# EAGLE design ADIS Teensy Arduino Breakout RevC (EAGLE 7.7.0)

## Sheet 1 of 2
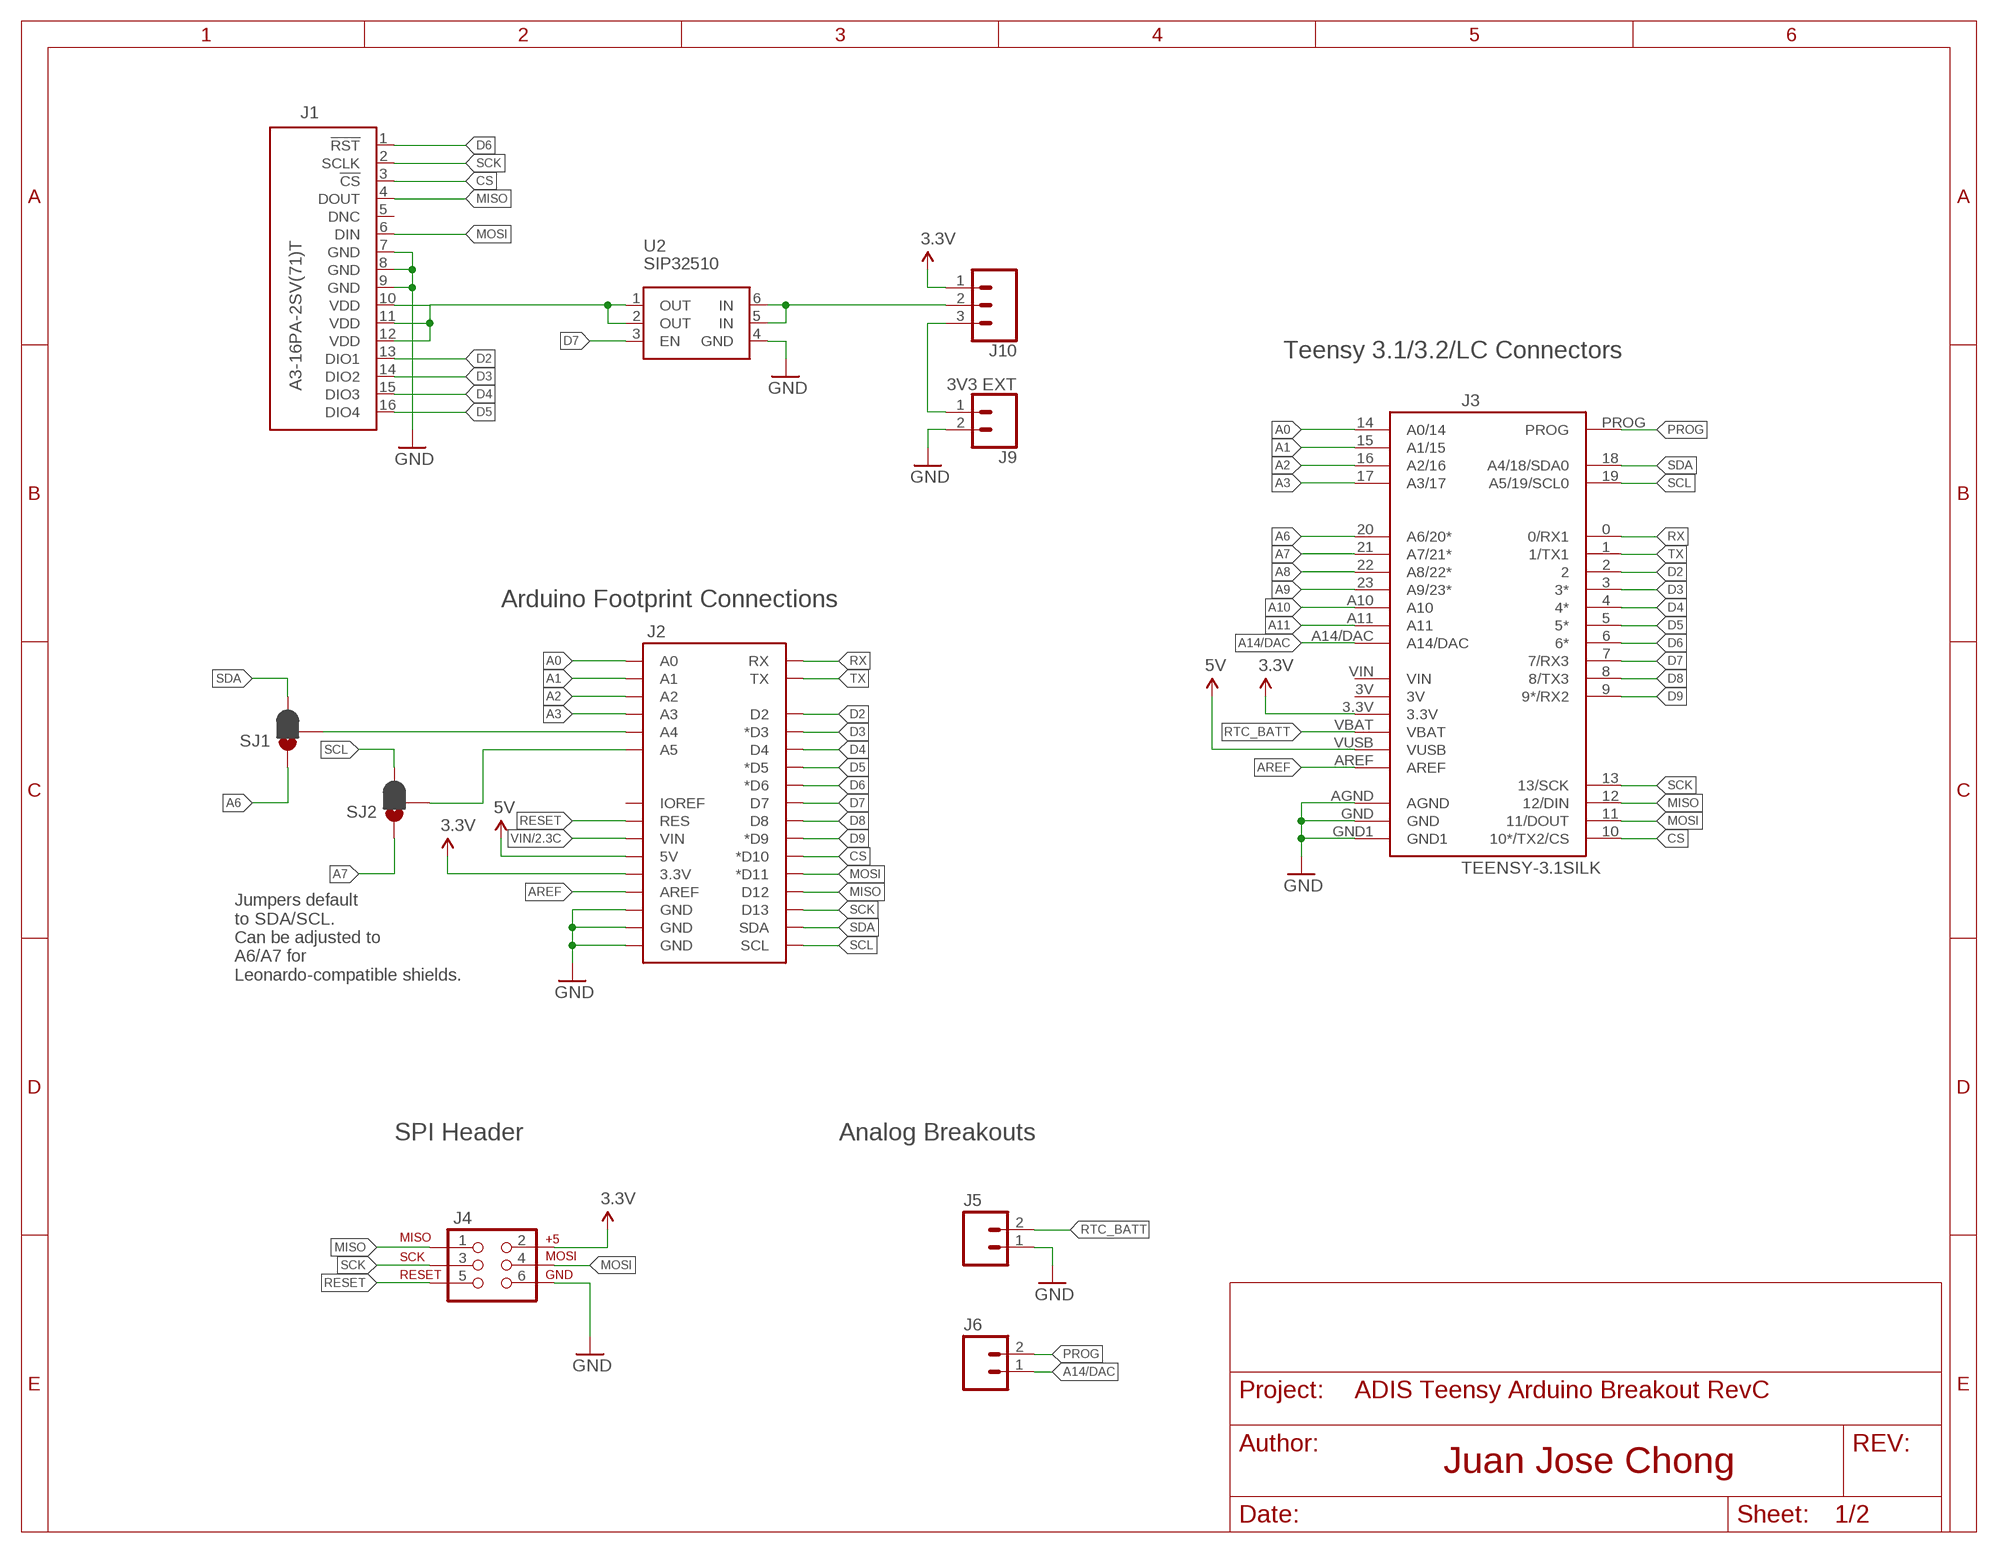
[diagram p0: schematic, sheet 1]

### Parts
J1  A3-16PA-2SV(71)T  [A3-16PA-2SV(71)-TOP]
J2  ARDUINO_R3_SHIELDUNO_R3_SHIELD_HOLES  [UNO_R3_SHIELD_HOLES]
J3  TEENSY-3.1SILK  [TEENSY-3.1]
J4  AVR_SPI_PRG_6PTH  [2X3]
J5  M02PTH  [1X02@1]
J6  M02PTH  [1X02@1]
J9  3V3 EXT  CONN_023.5MM  [SCREWTERMINAL-3.5MM-2]
J10  CONN_03  [1X03]
SJ1  JUMPER-PAD-3-2OF3_NC_BY_PASTE  [PAD-JUMPER-3-2OF3_NC_BY_PASTE_YES_SILK_FULL_BOX]
SJ2  JUMPER-PAD-3-2OF3_NC_BY_PASTE  [PAD-JUMPER-3-2OF3_NC_BY_PASTE_YES_SILK_FULL_BOX]
U2  SIP32510  [SOT23-6]

### Nets
3.3V: J2.3.3V J3.3.3V J4.2 J10.1 ; also sheet 2
5V: J2.5V J3.VUSB ; also sheet 2
A0: J2.A0 J3.14(A0/14)
A1: J2.A1 J3.15(A1/15)
A2: J2.A2 J3.16(A2/16)
A3: J2.A3 J3.17(A3/17)
A4: J2.A4 SJ1.2
A5: J2.A5 SJ2.2
A6: J3.20(A6/20*) SJ1.1
A7: J3.21(A7/21*) SJ2.1
A8: J3.22(A8/22*)
A9: J3.23(A9/23*)
A10: J3.A10
A11: J3.A11
A14/DAC: J3.A14/DAC J6.1
AREF: J2.AREF J3.AREF
CS: J1.3(!CS) J2.D10(*D10) J3.10(10*/TX2/CS)
D2: J1.13(DIO1) J2.D2 J3.2
D3: J1.14(DIO2) J2.D3(*D3) J3.3(3*)
D4: J1.15(DIO3) J2.D4 J3.4(4*)
D5: J1.16(DIO4) J2.D5(*D5) J3.5(5*)
D6: J1.1(!RST) J2.D6(*D6) J3.6(6*)
D7: J2.D7 J3.7(7/RX3) U2.3(EN)
D8: J2.D8 J3.8(8/TX3)
D9: J2.D9(*D9) J3.9(9*/RX2)
GND: J1.7(GND) J1.8(GND) J1.9(GND) J2.GND@0(GND) J2.GND@1(GND) J2.GND@2(GND) J3.AGND J3.GND J3.GND1 J4.6 J5.1 J9.2 U2.4(GND) ; also sheet 2
MISO: J1.4(DOUT) J2.D12 J3.12(12/DIN) J4.1
MOSI: J1.6(DIN) J2.D11(*D11) J3.11(11/DOUT) J4.4
N$8: J1.10(VDD) J1.11(VDD) J1.12(VDD) U2.1(OUT) U2.2(OUT)
N$10: J9.1 J10.3
N$11: J10.2 U2.5(IN) U2.6(IN)
PROG: J3.PROG J6.2
RESET: J2.RES J4.5
RTC_BATT: J3.VBAT J5.2
RX: J2.RX J3.0(0/RX1)
SCK: J1.2(SCLK) J2.D13 J3.13(13/SCK) J4.3
SCL: J2.SCL J3.19(A5/19/SCL0) SJ2.3
SDA: J2.SDA J3.18(A4/18/SDA0) SJ1.3
TX: J2.TX J3.1(1/TX1)
VIN: J2.VIN ; also sheet 2
Unconnected: J1.5(DNC) J2.IOREF J3.3V J3.VIN

### Notes on the sheet
- Teensy 3.1/3.2/LC Connectors
- Arduino Footprint Connections
- Jumpers default
  to SDA/SCL.
  Can be adjusted to 
  A6/A7 for
  Leonardo-compatible shields.
- SPI Header | Analog Breakouts

## Sheet 2 of 2
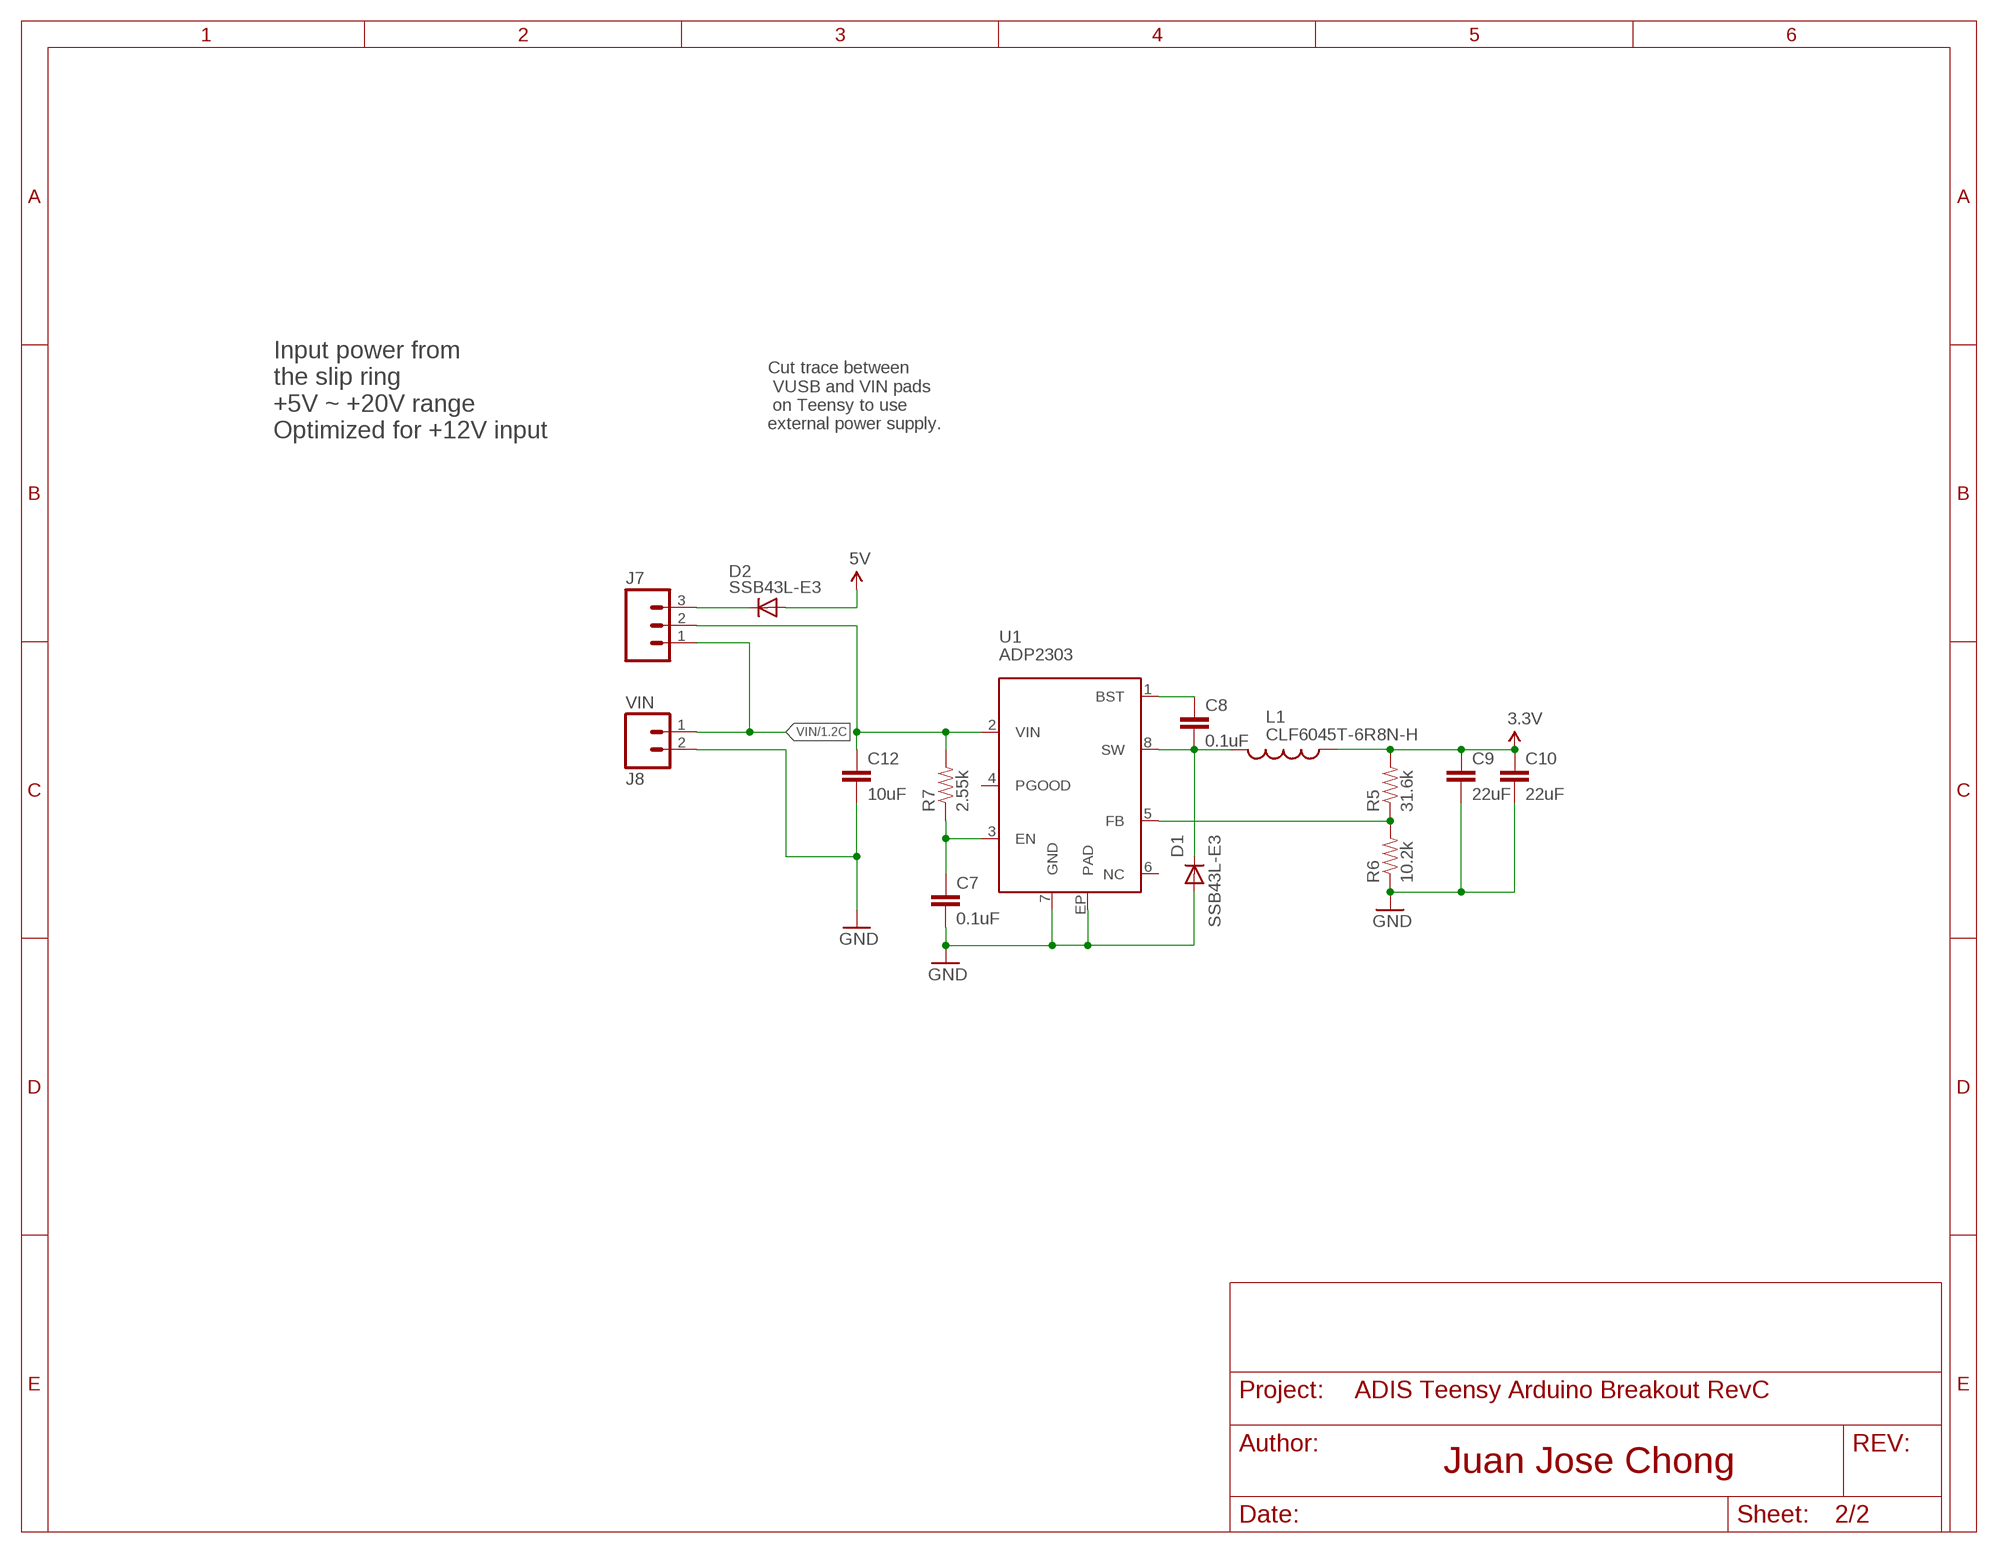
[diagram p1: schematic, sheet 2]

### Parts
C7  0.1uF  CAP0603-CAP  [0603-CAP]
C8  0.1uF  CAP0603-CAP  [0603-CAP]
C9  22uF  CAP1210  [1210]
C10  22uF  CAP1210  [1210]
C12  10uF  CAP1206  [1206]
D1  SSB43L-E3  DIODE-DO214AA  [DO214AA]
D2  SSB43L-E3  DIODE-DO214AA  [DO214AA]
J7  M03PTH  [1X03@1]
J8  VIN  M023.5MM  [SCREWTERMINAL-3.5MM-2@1]
L1  CLF6045T-6R8N-H  [CLF6045-H]
R5  31.6k  RESISTOR0603-RES  [0603-RES]
R6  10.2k  RESISTOR0603-RES  [0603-RES]
R7  2.55k  RESISTOR0603-RES  [0603-RES]
U1  ADP2303  [SOIC-8-PAD]

### Nets
3.3V: C9.1 C10.1 L1.P$1 R5.2 ; also sheet 1
5V: D2.A ; also sheet 1
GND: C7.2 C9.2 C10.2 C12.2 D1.A J8.2 R6.1 U1.7(GND) U1.EP(PAD) ; also sheet 1
N$2: R5.1 R6.2 U1.5(FB)
N$3: C8.2 D1.C L1.P$2 U1.8(SW)
N$4: C8.1 U1.1(BST)
N$5: C7.1 R7.1 U1.3(EN)
N$6: C12.1 J7.2 R7.2 U1.2(VIN)
N$7: D2.C J7.3
VIN: J7.1 J8.1 ; also sheet 1
Unconnected: U1.4(PGOOD) U1.6(NC)

### Notes on the sheet
- Cut trace between
   VUSB and VIN pads
   on Teensy to use 
  external power supply.
- Input power from 
  the slip ring
  +5V ~ +20V range
  Optimized for +12V input

## Library data of the parts
C7 C8 = SparkFun-Passives:CAP: Capacitor Standard 0603 ceramic capacitor, and 0.1" leaded capacitor.; PARTNO: CL10B104KB8NNNC
C9 C10 C12 = SparkFun-Passives:CAP: Capacitor Standard 0603 ceramic capacitor, and 0.1" leaded capacitor.; PARTNO: TLJA476M010R0600
D1 D2 = Chong:DIODE-: DIODE; PARTNO: SSB43L-E3/52T
J1 = Analog Devices iSensors:A3-16PA-2SV(71); PARTNO: A3-16PA-2SV(71)
J2 = Testing:ARDUINO_R3_SHIELD: Shield form compatible with the Arduino Uno R3.
J3 = Testing:TEENSY-3.1; PARTNO: TEENSY32; SF_ID: DEV-12646
J4 = SparkFun-Connectors:AVR_SPI_PRG_6: AVR ISP 6 Pin This is the reduced ISP connector for AVR programming. Common on Arduino. This footprint will take up less PCB space and can be used with a 10-pin to 6-pin adapter such as SKU: BOB-08508 **Special note about "TEST_POINT" package. The stop mask is on the top side, so if you want your programming test points to be on the bottom of your board, make sure to place this package on the bottom side of the board. This also ensure that the orientation to program from the bottom side will be correct.; PARTNO: M20-9720345
J5 J6 = SparkFun-Connectors:M02: Standard 2-pin 0.1" header. Use with - straight break away headers ( PRT-00116) - right angle break away headers (PRT-00553) - swiss pins (PRT-00743) - machine pins (PRT-00117) - female headers (PRT-00115) Molex polarized connector foot print use with: PRT-08233 with associated crimp pins and housings. 2.54_SCREWTERM for use with PRT-10571. 3.5mm Screw Terminal footprints for PRT-08084 5mm Screw Terminal footprints for use with PRT-08432
J7 = SparkFun-Connectors:M03: Header 3 Standard 3-pin 0.1" header. Use with straight break away headers (SKU : PRT-00116), right angle break away headers (PRT-00553), swiss pins (PRT-00743), machine pins (PRT-00117), and female headers (PRT-00115). Molex polarized connector foot print use with SKU : PRT-08232 with associated crimp pins and housings.; PARTNO: 68000-103HLF
J8 = SparkFun-Connectors:M02: Standard 2-pin 0.1" header. Use with - straight break away headers ( PRT-00116) - right angle break away headers (PRT-00553) - swiss pins (PRT-00743) - machine pins (PRT-00117) - female headers (PRT-00115) Molex polarized connector foot print use with: PRT-08233 with associated crimp pins and housings. 2.54_SCREWTERM for use with PRT-10571. 3.5mm Screw Terminal footprints for PRT-08084 5mm Screw Terminal footprints for use with PRT-08432; PARTNO: 20020327-C021B01LF
J9 = SparkFun-Connectors:CONN_02: Multi connection point. Often used as Generic Header-pin footprint for 0.1 inch spaced/style header connections On any of the 0.1 inch spaced packages, you can populate with these: Break Away Headers - Straight <https://www.sparkfun.com/products/116> (PRT-00116) Break Away Male Headers - Right Angle <https://www.sparkfun.com/products/553> (PRT-00553) Female Headers <https://www.sparkfun.com/products/115> (PRT-00115) Break Away Headers - Machine Pin <https://www.sparkfun.com/products/117> (PRT-00117) Break Away Female Headers - Swiss Machine Pin <https://www.sparkfun.com/products/743> (PRT-00743) For SCREWTERMINALS and SPRING TERMINALS visit here: Screw Terimnals on SparkFun.com <https://www.sparkfun.com/search/results?term=Screw+Terminals> (5mm/3.5mm/2.54mm spacing) This device is also useful as a general connection point to wire up your design to another part of your project. Our various solder wires solder well into these plated through hole pads. Hook-Up Wire - Assortment (Stranded, 22 AWG) <https://www.sparkfun.com/products/11375> (PRT-11375) Hook-Up Wire - Assortment (Solid Core, 22 AWG) <https://www.sparkfun.com/products/11367> (PRT-11367) View the entire wire category on our website here <https://www.sparkfun.com/categories/141> Special notes: Molex polarized connector foot print use with: PRT-08233 with associated crimp pins and housings. 2.54_SCREWTERM for use with PRT-10571. 3.5mm Screw Terminal footprints for PRT-08084 5mm Screw Terminal footprints for use with PRT-08432; PARTNO: 20020327-C021B01LF; PROD_ID: CONN-08399
J10 = SparkFun-Connectors:CONN_03: Multi connection point. Often used as Generic Header-pin footprint for 0.1 inch spaced/style header connections On any of the 0.1 inch spaced packages, you can populate with these: Break Away Headers - Straight <https://www.sparkfun.com/products/116> (PRT-00116) Break Away Male Headers - Right Angle <https://www.sparkfun.com/products/553> (PRT-00553) Female Headers <https://www.sparkfun.com/products/115> (PRT-00115) Break Away Headers - Machine Pin <https://www.sparkfun.com/products/117> (PRT-00117) Break Away Female Headers - Swiss Machine Pin <https://www.sparkfun.com/products/743> (PRT-00743) Stackable Header - 3 Pin (Female, 0.1") <https://www.sparkfun.com/products/13875> (PRT-13875) For SCREWTERMINALS and SPRING TERMINALS visit here: Screw Terimnals on SparkFun.com <https://www.sparkfun.com/search/results?term=Screw+Terminals> (5mm/3.5mm/2.54mm spacing) This device is also useful as a general connection point to wire up your design to another part of your project. Our various solder wires solder well into these plated through hole pads. Hook-Up Wire - Assortment (Stranded, 22 AWG) <https://www.sparkfun.com/products/11375> (PRT-11375) Hook-Up Wire - Assortment (Solid Core, 22 AWG) <https://www.sparkfun.com/products/11367> (PRT-11367) View the entire wire category on our website here <https://www.sparkfun.com/categories/141> Special notes: Molex polarized connector foot print use with SKU : PRT-08232 with associated crimp pins and housings.; PARTNO: 68000-103HLF
L1 = AnalogDevices:CLF6045T-6R8N-H; PARTNO: CLF6045T-6R8N-H
R5 = SparkFun-Passives:RESISTOR: Resistor Basic schematic elements and footprints for 0603, 1206, and PTH resistors.; PARTNO: ERJ-3EKF3162V
R6 = SparkFun-Passives:RESISTOR: Resistor Basic schematic elements and footprints for 0603, 1206, and PTH resistors.; PARTNO: ERJ-3EKF1022V
R7 = SparkFun-Passives:RESISTOR: Resistor Basic schematic elements and footprints for 0603, 1206, and PTH resistors.; PARTNO: ERJ-3EKF2551V
SJ1 SJ2 = SparkFun-Passives:JUMPER-PAD-3-2OF3_NC_BY_PASTE
U1 = AnalogDevices:ADP2303; PARTNO: ADP2303ARDZ
U2 = Chong:SIP32510; PARTNO: SIP32510DT-T1-GE3

## Board
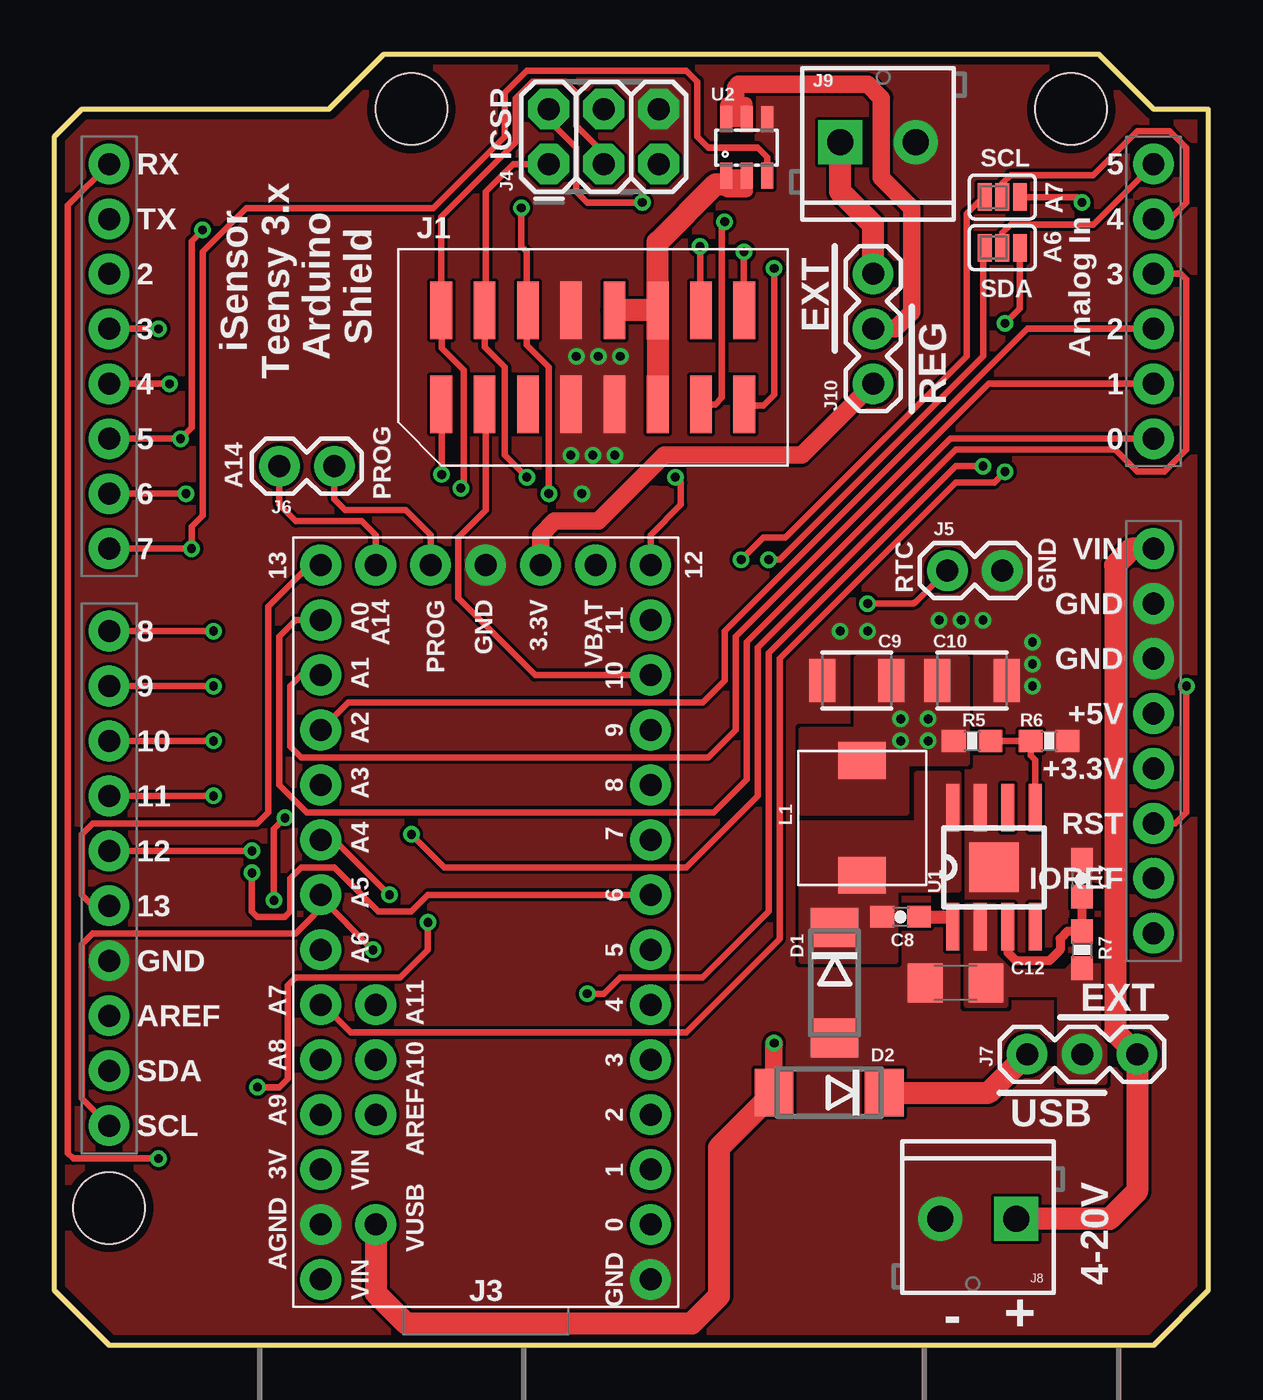
[diagram p2: board, top side]
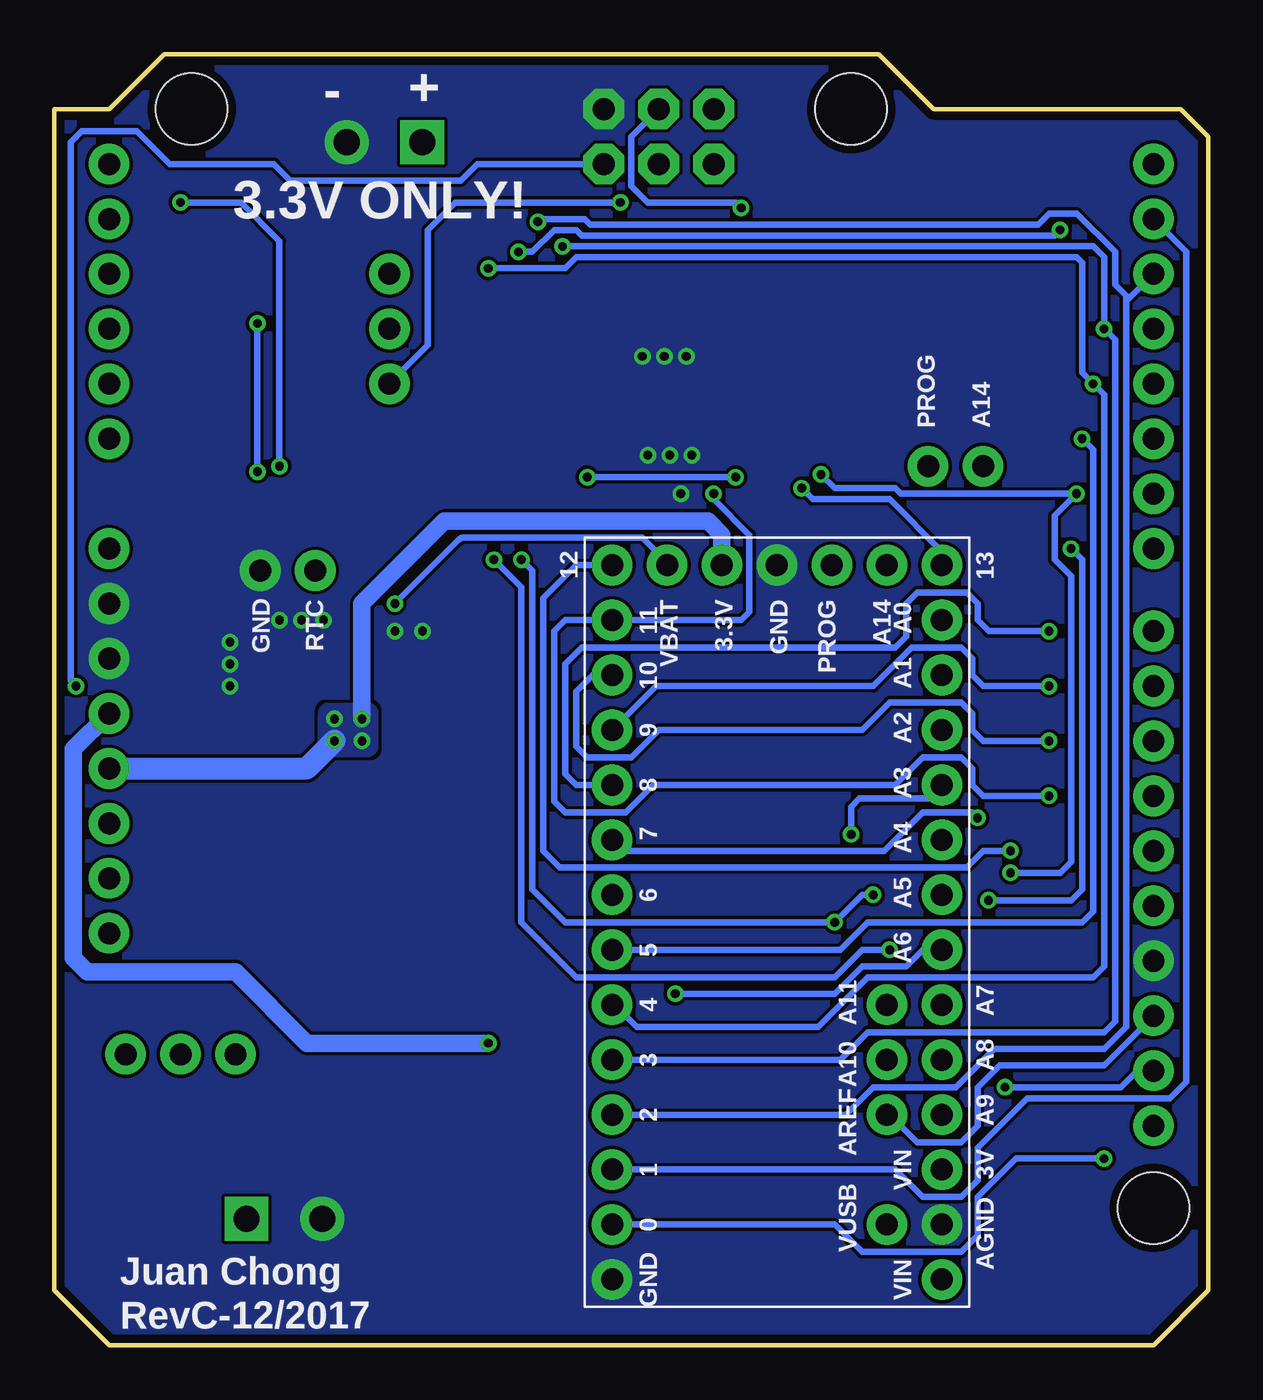
[diagram p3: board, bottom side, seen from below]

Size 53.34 x 59.69 mm. Coordinates in mm from the lower left corner, seen from the top.
Outline: 0,2.54 2.54,0 50.8,0 53.34,2.54 53.34,57.15 50.8,57.15 48.26,59.69 15.24,59.69 12.7,57.15 1.27,57.15 0,55.88 0,2.54
Copper layers (1*16): Top 0.0356mm / dielectric 1.5011mm / Bottom 0.0356mm
Design rules "LaenPCBOrder_FilledVias *": minimum track width 6mil, minimum drill 10mil, track to track 6mil, track to pad 6mil, pad to pad 6mil, via to via 6mil, smd to smd 6mil, copper to edge 15mil, drill to drill 6mil, minimum pad ring 7mil, minimum via ring 7mil, stop-mask expansion 4mil, vias tented up to drill 17mil, thermal gap 10mil
tRestrict: 10 lines
bRestrict: 1 lines

### Footprints (pad centres in the part's own frame; a part is rotated, then mirrored left to right if it is on the bottom)
0603-CAP = smd 1.1 x 1: 1 -0.85,0; 2 0.85,0
1210 = smd 1.2 x 2: 1 -1.6,0; 2 1.6,0
1206 = smd 1.6 x 1.8: 1 -1.4,0; 2 1.4,0
DO214AA = smd 1.8 x 2.2: A 2.55,0; C -2.55,0
A3-16PA-2SV(71)-TOP = smd 1 x 2.65: 1 -7,-2.225; 2 -7,2.125; 3 -5,-2.225; 4 -5,2.125; 5 -3,-2.225; 6 -3,2.125; 7 -1,-2.225; 8 -1,2.125; 9 1,-2.225; 10 1,2.125; 11 3,-2.225; 12 3,2.125; 13 5,-2.225; 14 5,2.125; 15 7,-2.225; 16 7,2.125
UNO_R3_SHIELD_HOLES = drill 1.016 pad 1.88: 3.3V 50.8,26.67; 5V 50.8,29.21; A0 50.8,41.91; A1 50.8,44.45; A2 50.8,46.99; A3 50.8,49.53; A4 50.8,52.07; A5 50.8,54.61; AREF 2.54,15.24; D2 2.54,49.53; D3 2.54,46.99; D4 2.54,44.45; D5 2.54,41.91; D6 2.54,39.37; D7 2.54,36.83; D8 2.54,33.02; D9 2.54,30.48; D10 2.54,27.94; D11 2.54,25.4; D12 2.54,22.86; D13 2.54,20.32; GND@0 50.8,31.75; GND@1 50.8,34.29; GND@2 2.54,17.78; IOREF 50.8,21.59; NC 50.8,19.05; RES 50.8,24.13; RX 2.54,54.61; SCL 2.54,10.16; SDA 2.54,12.7; TX 2.54,52.07; VIN 50.8,36.83 | hole 3.302: 2.54,6.35; 46.99,57.15; 16.51,57.15
TEENSY-3.1 = drill 1.016 pad 1.88: 0 16.51,3.81; 1 16.51,6.35; 2 16.51,8.89; 3 16.51,11.43; 3.3V 11.43,34.29; 3V 1.27,6.35; 4 16.51,13.97; 5 16.51,16.51; 6 16.51,19.05; 7 16.51,21.59; 8 16.51,24.13; 9 16.51,26.67; 10 16.51,29.21; 11 16.51,31.75; 12 16.51,34.29; 13 1.27,34.29; 14 1.27,31.75; 15 1.27,29.21; 16 1.27,26.67; 17 1.27,24.13; 18 1.27,21.59; 19 1.27,19.05; 20 1.27,16.51; 21 1.27,13.97; 22 1.27,11.43; 23 1.27,8.89; A10 3.81,11.43; A11 3.81,13.97; A14/DAC 3.81,34.29; AGND 1.27,3.81; AREF 3.81,8.89; GND 8.89,34.29; GND1 16.51,1.27; PROG 6.35,34.29; VBAT 13.97,34.29; VIN 1.27,1.27; VUSB 3.81,3.81
2X3 = drill 1.016 pad 1.88 octagon: 1 0,0; 2 0,2.54; 3 2.54,0; 4 2.54,2.54; 5 5.08,0; 6 5.08,2.54
1X02@1 = drill 1.016 pad 1.88: 1 0,0; 2 2.54,0
1X03@1 = drill 1.016 pad 1.88: 1 0,0; 2 2.54,0; 3 5.08,0
SCREWTERMINAL-3.5MM-2@1 = drill 1.2 pad 2.032 square: 1 0,0 | drill 1.2 pad 2.032: 2 3.5,0
SCREWTERMINAL-3.5MM-2 = drill 1.2 pad 2.032 square: 1 0,0 | drill 1.2 pad 2.032: 2 3.5,0
1X03 = drill 1.016 pad 1.88: 1 0,0; 2 2.54,0; 3 5.08,0
CLF6045-H = smd 1.7 x 2.2: P$1 -2.65,0; P$2 2.65,0
0603-RES = smd 1.1 x 1: 1 -0.85,0; 2 0.85,0
PAD-JUMPER-3-2OF3_NC_BY_PASTE_YES_SILK_FULL_BOX = smd 0.635 x 1.27: 1 -0.813,0; 2 0,0; 3 0.813,0
SOIC-8-PAD = smd 0.6 x 2.2: 1 -1.905,-2.75; 2 -0.635,-2.75; 3 0.635,-2.75; 4 1.905,-2.75; 5 1.905,2.75; 6 0.635,2.75; 7 -0.635,2.75; 8 -1.905,2.75 | smd 2.29 x 2.29: EP 0,0
SOT23-6 = smd 0.55 x 1.2: 1 -0.95,-1.3; 2 0,-1.3; 3 0.95,-1.3; 4 0.95,1.3; 5 0,1.3; 6 -0.95,1.3

### Placement (x,y rotation side)
C7  47.5,21.59 90 top
C8  39.12,19.81 180 top
C9  37.08,30.73 180 top
C10  42.42,30.73 0 top
C12  41.66,16.76 180 top
D1  36.07,16.76 270 top
D2  35.81,11.68 180 top
J1  24.89,45.72 0 top
J2  0,0 0 top
J3  11.05,1.78 0 top
J4  22.86,54.61 0 top
J5  43.81,35.81 180 top
J6  10.41,40.64 0 top
J7  50.04,13.46 180 top
J8  44.45,5.84 180 top
J9  36.32,55.63 0 top
J10  37.85,44.45 90 top
L1  37.34,24.38 270 top
R5  42.42,27.94 180 top
R6  45.97,27.94 180 top
R7  47.5,18.29 270 top
SJ1  43.81,53.09 180 top
SJ2  43.81,50.74 180 top
U1  43.43,22.1 0 top
U2  32,55.37 0 top

### Tracks (layer width: path | path; a pad name or v marks a point on that pad's centre or on a via)
3.3V  (via drill 0.41)
  Top 0.305: J4.2 22.86,56.64 24.13,55.37 24.13,53.47 arc45 24.22,53.25 24.64,52.83 v27.18,52.83
  Top 0.813: 22.4,36.15 J3.3.3V 22.48,37.47 23.11,38.1 25.15,38.1 28.19,41.15 34.54,41.15 J10.1
  Bottom 0.305: v27.18,52.83 34.8,52.83 36.07,51.56 36.07,46.23 J10.1
  Bottom 0.813: J3.3.3V 22.48,37.47 23.11,38.1 35.31,38.1 39.12,34.29 v39.12,28.96
  Bottom 1.016: J2.3.3V 41.66,26.67 v40.39,27.94
  other vias: 40.39,28.96 39.12,27.94
  pour Top (no thermals): 39.37,24.64 39.37,26.92 42.16,26.92 42.16,31.75 37.08,31.75 37.08,28.45 34.54,28.45 34.54,24.64
  pour Bottom (no thermals): 38.86,29.21 38.86,27.69 40.64,27.69 40.64,29.21
5V  (via drill 0.41)
  Top 0.813: D2.A v33.26,13.96 v33.27,13.97
  Top 1.016: J3.VUSB 14.86,2.41 16.26,1.02 29.46,1.02 30.73,2.29 30.73,9.15 D2.A
  Bottom 0.813: v33.27,13.97 41.66,13.97 44.96,17.27 51.82,17.27 52.45,17.91 52.45,27.56 J2.5V
A0
  Top 0.305: J2.A0 41.4,41.91 32,32.51 32,26.16 30.48,24.64 11.68,24.64 10.41,25.91 10.41,32.77 11.18,33.53 J3.14
A1
  Top 0.305: J2.A1 43.18,44.45 31.5,32.77 31.5,28.45 30.23,27.18 11.43,27.18 10.92,27.69 10.92,30.48 11.43,30.99 J3.15
A2
  Top 0.305: J2.A2 44.96,46.99 30.99,33.02 30.99,30.73 29.97,29.72 13.59,29.72 J3.16
A3  (via drill 0.41)
  Top 0.305: J2.A3 52.07,49.53 52.32,49.28 52.32,41.4 51.31,40.39 50.04,40.39 49.02,41.4 41.66,41.4 32.51,32.26 32.51,25.4 29.21,22.1 18.03,22.1 v16.51,23.62
  Bottom 0.305: v16.51,23.62 16.51,24.89 16.13,25.27 12.95,25.27 J3.17
A4
  Top 0.305: J2.A4 51.56,52.07 52.32,52.83 52.32,55.37 51.56,56.13 50.04,56.13 48.01,54.1 44.2,54.1 43.81,53.72 SJ1.2
A5
  Top 0.305: J2.A5 48.01,51.82 44.2,51.82 43.81,51.43 SJ2.2
A6  (via drill 0.41)
  Top 0.305: v24.64,16.26 25.4,16.26 26.16,17.02 29.97,17.02 33.02,20.07 33.02,32 41.66,40.64 v42.93,40.64 | SJ1.1 47.24,53.09 v47.5,52.83
  Bottom 0.305: J3.20 13.21,18.29 13.97,17.53 16,17.53 17.27,16.26 v24.64,16.26 | v42.93,40.64 42.93,51.05 44.7,52.83 v47.5,52.83
A7  (via drill 0.41)
  Top 0.305: J3.21 12.45,15.75 13.72,14.48 29.21,14.48 33.53,18.8 33.53,31.75 41.66,39.88 43.43,39.88 v43.94,40.39 | SJ2.1 44.63,47.93 v43.94,47.24
  Bottom 0.305: v43.94,40.39 v43.94,47.24
A14/DAC
  Top 0.305: J3.A14/DAC 14.86,37.47 14.22,38.1 11.18,38.1 10.41,38.86 J6.1
AREF
  Bottom 0.305: J3.AREF 14.73,10.67 13.46,9.4 11.43,9.4 10.67,10.16 10.67,11.94 9.65,12.95 4.83,12.95 J2.AREF
CS  (via drill 0.41)
  Top 0.305: J2.D10 v7.37,27.94 | J3.10 22.23,30.99 18.67,34.54 18.67,37.34 19.94,38.61 19.94,43.45 J1.3
  Bottom 0.305: v7.37,27.94 10.41,27.94 10.92,28.45 10.92,29.21 11.43,29.72 14.73,29.72 16,28.45 25.4,28.45 26.67,27.18 28.7,27.18 29.21,27.69 29.21,30.23 28.45,30.99 J3.10
D2  (via drill 0.41)
  Top 0.305: 29.84,43.54 J1.13 30.54,43.5 30.86,43.81 30.86,51.82 v30.99,51.94
  Bottom 0.305: J3.2 16.76,10.67 15.49,11.94 11.68,11.94 9.91,13.72 4.83,13.72 3.81,14.73 3.81,48.26 | 3.81,48.26 J2.D2 | 3.81,48.26 3.81,48.51 4.32,49.02 4.32,50.55 6.1,52.32 7.37,52.32 7.87,51.82 28.57,51.82 28.83,52.07 30.86,52.07 v30.99,51.94
D3  (via drill 0.41)
  Top 0.305: v4.83,46.99 J2.D3 | v29.84,50.8 29.84,47.89 J1.14
  Bottom 0.305: J3.3 17.02,13.21 15.75,14.48 4.83,14.48 4.32,14.99 4.32,46.48 v4.83,46.99 4.83,50.29 5.33,50.8 v29.84,50.8
D4  (via drill 0.41)
  Top 0.305: v5.33,44.45 J2.D4 | v33.27,49.78 33.27,43.94 32.77,43.43 31.95,43.43 J1.15
  Bottom 0.305: J3.4 27.43,15.75 26.42,14.73 18.03,14.73 15.75,17.02 5.33,17.02 4.83,17.53 4.83,43.94 v5.33,44.45 5.84,44.96 5.84,50.04 6.1,50.29 29.21,50.29 29.72,49.78 v33.27,49.78
D5  (via drill 0.41)
  Top 0.305: J2.D5 v5.84,41.91 6.35,42.42 6.35,51.05 v6.86,51.56 | v31.88,50.55 31.88,47.86 J1.16
  Bottom 0.305: J3.5 17.02,18.29 15.75,19.56 5.84,19.56 5.33,20.07 5.33,41.4 v5.84,41.91 | v6.86,51.56 7.11,51.31 28.96,51.31 29.21,51.56 30.23,51.56 31.24,50.55 v31.88,50.55
D6  (via drill 0.41)
  Top 0.305: v6.1,39.37 J2.D6 | v9.14,21.84 9.14,20.07 9.4,19.81 10.67,19.81 10.92,20.07 10.92,21.59 11.43,22.1 12.95,22.1 14.99,20.07 16.51,20.07 17.27,20.83 J3.6 | v17.91,40.26 17.91,43.48 J1.1
  Bottom 0.305: v9.14,21.84 6.86,21.84 6.35,22.35 6.35,35.56 7.11,36.32 7.11,38.35 v6.1,39.37 14.22,39.37 14.48,39.62 17.27,39.62 v17.91,40.26
D7  (via drill 0.41)
  Top 0.305: J2.D7 v6.35,36.83 6.35,37.85 6.86,38.35 6.86,50.55 8.89,52.58 17.53,52.58 20.83,55.88 20.83,57.91 21.84,58.93 29.21,58.93 29.72,58.42 29.72,55.88 30.23,55.37 32.51,55.37 32.95,54.93 U2.3 | v10.16,20.57 10.16,23.88 v10.67,24.38
  Bottom 0.305: v10.16,20.57 6.35,20.57 5.84,21.08 5.84,36.32 v6.35,36.83 | v10.67,24.38 10.92,24.64 13.21,24.64 14.99,22.86 27.05,22.86 J3.7
D8  (via drill 0.41)
  Top 0.305: J2.D8 v7.37,33.02
  Bottom 0.305: J3.8 29.21,25.91 29.72,26.42 29.72,31.5 28.96,32.26 14.48,32.26 13.97,32.77 13.97,34.29 13.46,34.8 11.18,34.8 10.67,34.29 10.67,33.53 10.16,33.02 v7.37,33.02
D9  (via drill 0.41)
  Top 0.305: J2.D9 v7.37,30.48
  Bottom 0.305: v7.37,30.48 10.41,30.48 10.92,30.99 10.92,31.75 11.43,32.26 13.72,32.26 15.49,30.48 25.53,30.48 J3.9
GND  (via drill 0.41)
  other vias: 36.32,33.02 45.21,31.5 45.21,30.48 45.21,32.51 23.88,41.15 24.89,41.15 25.91,41.15 24.38,39.37 24.13,45.72 25.15,45.72 26.16,45.72 37.59,33.02 40.89,33.53 41.91,33.53 42.93,33.53
  pour Bottom (rank 6, no thermals): 0,55.88 1.27,57.15 12.7,57.15 15.24,59.69 48.26,59.69 50.8,57.15 53.34,57.15 53.34,2.54 50.8,0 2.54,0 0,2.54
  pour Top (rank 6, no thermals): 1.27,57.15 12.7,57.15 15.24,59.69 48.26,59.69 50.8,57.15 53.34,57.15 53.34,2.54 50.8,0 2.54,0 0,2.54 0,55.88
MISO  (via drill 0.41)
  Top 0.305: J2.D12 v9.14,22.86 | J4.1 21.21,54.61 19.94,53.34 19.94,47.89 J1.4 19.89,46.15 20.83,45.21 20.83,41.15 v21.84,40.13 | J3.12 27.56,37.47 28.96,38.86 28.96,39.88 v28.7,40.13
  Bottom 0.305: v9.14,22.86 10.41,22.86 11.18,22.1 29.97,22.1 30.73,22.86 30.73,34.54 29.21,36.07 J3.12 | v28.7,40.13 v21.84,40.13
MOSI  (via drill 0.41)
  Top 0.305: J2.D11 v7.37,25.4 | v21.59,52.58 21.59,50.8 21.84,50.55 21.84,47.89 J1.6 21.84,47.8 21.84,46.23 22.86,45.21 v22.86,39.37
  Bottom 0.305: v7.37,25.4 10.41,25.4 10.92,25.91 10.92,26.67 11.43,27.18 13.21,27.18 14.48,25.91 25.65,25.91 26.92,24.64 29.72,24.64 30.23,25.15 30.23,33.02 29.72,33.53 J3.11 21.59,33.53 21.21,33.91 21.21,37.47 22.86,39.12 v22.86,39.37 | J4.4 26.67,55.88 26.67,53.59 25.91,52.83 21.84,52.83 v21.59,52.58
N$2
  Top 0.305: R5.1 R6.2 45.12,27.27 45.34,27.05 U1.5
N$3
  pour Top (no thermals): 41.78,26.42 39.88,26.42 39.88,24.13 34.54,24.13 34.54,17.78 38.86,17.78 38.86,21.08 41.78,21.08
N$4
  Top 0.305: 41.4,19.81 41.4,19.47 U1.1
  Top 0.61: C8.1 41.4,19.81
N$5
  Top 0.406: C7.1 R7.1 46.82,19.14 46.48,18.8 46.48,18.29 45.97,17.78 44.45,17.78 44.07,18.16 U1.3
N$6
  pour Top (no thermals): 42.16,20.32 42.16,15.75 43.94,15.75 43.94,16.26 46.48,16.26 46.48,12.19 48.51,12.19 48.51,17.53 46.99,17.53 46.74,17.27 44.2,17.27 43.43,18.03 43.43,20.32
N$7
  Top 1.016: D2.C 43.18,11.68 J7.3
N$8
  Top 0.305: U2.1 31.04,54.06 31.04,53.34 31.27,53.34 U2.2
  Top 0.508: 31.04,53.72 31.04,53.34 32.03,53.34 32.03,53.72 | 32.03,53.72 32.03,54.1 31.04,54.1 31.04,53.72 | 31.04,53.72 31.5,53.72 32.03,53.72
  Top 1.016: J1.12 27.89,51.01 30.56,53.67 31.45,53.67 31.5,53.72 | J1.12 J1.10 | J1.12 J1.11
N$10
  Top 1.016: J10.3 37.85,51.82 36.32,53.34 J9.1
N$11
  Top 0.305: U2.5 31.98,56.64
  Top 0.508: 31.98,56.64 31.98,56.9 31.24,56.9 | 31.98,57.4 31.5,57.4 | U2.6 31.03,57.34 31.09,57.4
  Top 0.61: 31.24,56.64 31.98,56.64 | 31.98,56.9 31.98,57.4 | 31.5,57.4 31.09,57.4 31.09,56.64
  Top 0.813: J10.2 38.86,46.99 39.62,47.75 39.62,52.58 38.23,53.97 38.23,57.66 37.59,58.29 31.62,58.29 31.5,58.17 31.5,57.4
PROG
  Top 0.305: J3.PROG 17.4,37.47 16.26,38.61 13.46,38.61 12.95,39.12 J6.2
RESET  (via drill 0.41)
  Top 0.305: v52.32,30.48 52.32,24.64 51.82,24.13 J2.RES
  Bottom 0.305: v52.32,30.48 52.58,30.73 52.58,55.63 52.07,56.13 49.53,56.13 48.01,54.61 43.18,54.61 42.42,53.85 34.54,53.85 33.78,54.61 J4.5
RTC_BATT  (via drill 0.41)
  Top 0.305: v37.59,34.29 39.62,34.29 arc45 39.84,34.38 J5.2
  Bottom 0.305: J3.VBAT arc-45 25.11,36.28 26.16,37.34 34.41,37.34 arc-45 34.64,37.25 v37.59,34.29
RX  (via drill 0.41)
  Top 0.305: J2.RX 0.63,52.7 0.63,8.89 0.89,8.64 v4.83,8.64
  Bottom 0.305: J3.0 17.27,5.59 16,4.32 11.43,4.32 10.67,5.08 10.67,6.86 8.89,8.64 v4.83,8.64
SCK  (via drill 0.41)
  Top 0.305: J2.D13 1.78,20.32 1.27,20.83 1.27,23.62 1.78,24.13 9.4,24.13 9.91,24.64 9.91,34.16 11.81,36.07 J3.13 | J4.3 25.4,55.12 24.13,56.39 24.13,57.91 23.62,58.42 22.1,58.42 21.34,57.66 21.34,55.63 17.89,52.18 J1.2 17.91,47.83 17.91,46.1 18.92,45.08 18.92,39.75 v18.8,39.62
  Bottom 0.305: J3.13 12.32,36.7 14.73,39.12 18.29,39.12 v18.8,39.62
SCL  (via drill 0.41)
  Top 0.305: J2.SCL 1.27,11.43 1.27,18.54 1.78,19.05 11.18,19.05 12.32,20.19 J3.19 12.32,20.7 v14.73,18.29 | v33.02,36.32 33.53,36.32 42.93,45.72 42.93,50.15 SJ2.3
  Bottom 0.305: v14.73,18.29 16,18.29 17.27,17.02 29.21,17.02 31.75,19.56 31.75,35.05 v33.02,36.32
SDA  (via drill 0.41)
  Top 0.305: J3.18 12.95,23.37 v15.49,20.83 | v17.27,19.56 17.27,18.29 16,17.02 11.18,17.02 10.8,16.64 10.8,12.32 10.41,11.94 v9.4,11.94 | v31.75,36.32 32.77,37.34 33.78,37.34 42.16,45.72 42.16,52.32 42.93,53.09 SJ1.3
  Bottom 0.305: v9.4,11.94 4.06,11.94 3.3,12.7 J2.SDA | v15.49,20.83 16,20.83 v17.27,19.56 29.72,19.56 31.24,21.08 31.24,35.81 v31.75,36.32
TX
  Bottom 0.305: J3.1 14.48,8.13 13.21,6.86 11.43,6.86 10.67,7.62 10.67,9.14 8.38,11.43 1.78,11.43 1.02,12.19 1.02,50.55 J2.TX
VIN
  Top 1.016: J2.VIN 49.78,36.83 49.02,36.07 49.02,14.48 J7.1 50.04,7.11 48.77,5.84 J8.1

### Text on the board
tPlace: ICSP | SCL | A7 | EXT | A6 | iSensor / Teensy 3.x / Arduino / Shield | SDA | REG | A14 | PROG | RTC | GND | EXT | USB | - | 4-20V | +
bPlace: - | + | 3.3V ONLY! | A14 | PROG | RTC | GND | Juan Chong | RevC-12/2017